# Altium schematic sheet Connectors.SchDoc
size A3
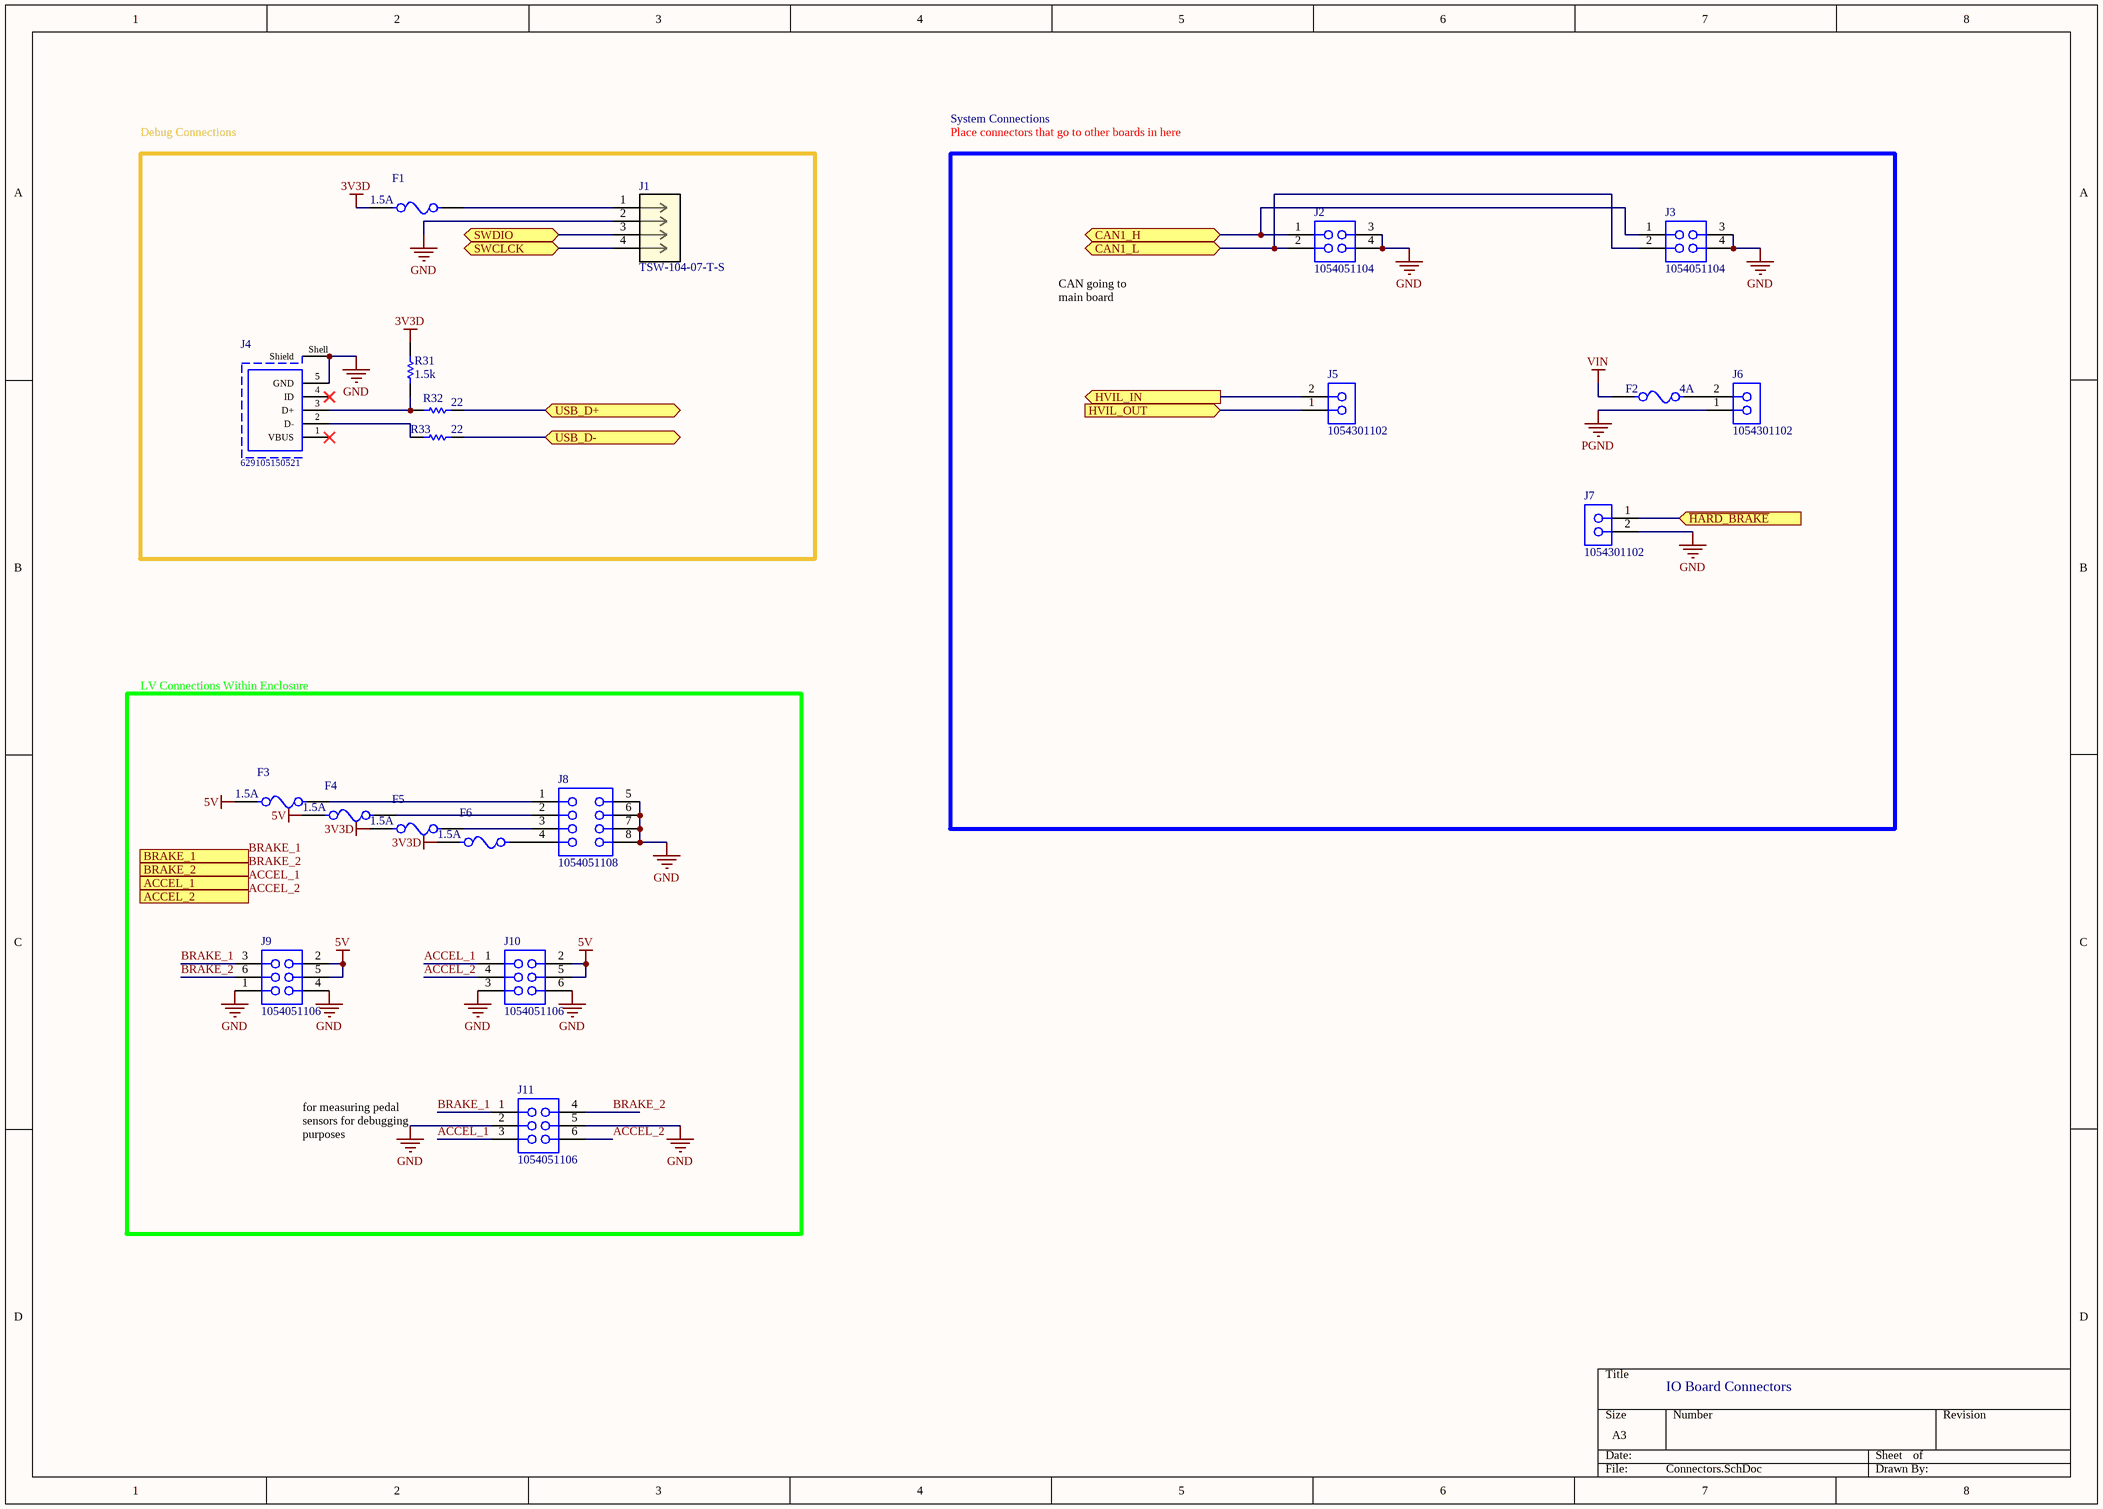
[diagram p0: Connectors.SchDoc]

## Parts
F1  1.5A  [FUSC1608X43N]
F2  4A  [0466004.NR]
F3  1.5A  [FUSC1608X43N]
F4  1.5A  [FUSC1608X43N]
F5  1.5A  [FUSC1608X43N]
F6  1.5A  [FUSC1608X43N]
J1  TSW-104-07-T-S  [CON4_1X4_TU_TSW]
J2  1054051104  [1054051104]
J3  1054051104  [1054051104]
J4  629105150521  [629105150521]
J5  1054301102  [1054301102]
J6  1054301102  [1054301102]
J7  1054301102  [1054301102]
J8  1054051108  [1054051108]
J9  1054051106  [1054051106]
J10  1054051106  [1054051106]
J11  1054051106  [1054051106]
R31  1.5k  [RESC2013X50X35ML15T15]
R32  22  [RESC0805(2012)_L]
R33  22  [RESC2013X50X35ML15T15]

## Blocks framed on the sheet
Debug Connections: F1 J1 J4 R31-R33
Place connectors that go to other boards in here: F2 J2 J3 J5-J7
LV Connections Within Enclosure: F3-F6 J8-J11

## Ports
ACCEL_1 (out), ACCEL_2 (out), BRAKE_1 (out), BRAKE_2 (out), CAN1_H (bidir), CAN1_L (bidir), HVIL_IN (out), HVIL_OUT (in), SWCLCK (bidir), SWDIO (bidir), USB_D+ (bidir), USB_D- (bidir), ~{HARD_BRAKE} (in)

## Nets
3V3D: F1.1 F5.1 F6.1 R31.1
5V: F3.1 F4.1 J9.2 J9.5 J10.2 J10.5
GND: J1.2 J2.3 J2.4 J3.3 J3.4 J4.5(GND) J4.Shell(Shield) J7.2 J8.5 J8.6 J8.7 J8.8 J9.1 J9.4 J10.3 J10.6 J11.2 J11.5
PGND: J6.1
VIN: F2.1
ACCEL_1: J10.1 J11.3 ; port ACCEL_1
ACCEL_2: J10.4 J11.6 ; port ACCEL_2
BRAKE_1: J9.3 J11.1 ; port BRAKE_1
BRAKE_2: J9.6 J11.4 ; port BRAKE_2
CAN1_H: J2.1 J3.1 ; port CAN1_H
CAN1_L: J2.2 J3.2 ; port CAN1_L
~{HARD_BRAKE}: J7.1 ; port ~{HARD_BRAKE}
HVIL_IN: J5.2 ; port HVIL_IN
HVIL_OUT: J5.1 ; port HVIL_OUT
SWCLCK: J1.4 ; port SWCLCK
SWDIO: J1.3 ; port SWDIO
USB_D+: R32.1 ; port USB_D+
USB_D-: R33.1 ; port USB_D-
NetF1_2: F1.2 J1.1
NetF2_2: F2.2 J6.2
NetF3_2: F3.2 J8.1
NetF4_2: F4.2 J8.2
NetF5_2: F5.2 J8.3
NetF6_2: F6.2 J8.4
NetJ4_2: J4.2(D-) R33.2
NetJ4_3: J4.3(D+) R31.2 R32.2

Not connected (* = marked no-connect by the designer): J4 1(VBUS)* 4(ID)*

## Notes on the sheet
- System Connections
- CAN going to main board
- for measuring pedal sensors for debugging purposes
- IO Board Connectors

## Library data of the parts
F1 F3-F6 = 046701.5NR: 1.5A 0603 Fuse; Manufacturer_Name: LITTELFUSE; Datasheet Link: https://www.littelfuse.com/~/media/electronics/datasheets/fuses/littelfuse_fuse_467_datasheet.pdf.pdf; Height: 0.432mm; Manufacturer_Part_Number: 046701.5NR; Arrow Part Number: 046701.5NR; Arrow Price/Stock: https://www.arrow.com/en/products/046701.5nr/littelfuse; Mouser Part Number: 576-046701.5NR; Mouser Price/Stock: https://www.mouser.com/Search/Refine.aspx?Keyword=576-046701.5NR; Value: 1.5A
F2 = 0466004.NR: FUSE BOARD MNT 4A 32VAC/VDC 1206; Manufacturer: Littelfuse; DC Cold Resistance: 14mR; Voltage Rating (AC): 32V; Fuse Type: Board Mount (Cartridge Style Excluded); Approvals: UL,CSA; Supplier 1: Digi-Key; Manufacturer Part Number: 0466004.NR; RoHS: Yes; Category: Fuses; Stock 1: 7288; Pricing 1: 1=0.85000, 5=0.82000, 10=0.76800, 50=0.63520, 100=0.52930, 250=0.51608, 500=0.43668, 1000=0.38376 (USD); Mount: Surface Mount; Case/Package: 1206; Case Code (Imperial): 1206; Case Code (Metric): 3216; Min Operating Temperature: -55°C; Max Operating Temperature: 90°C; Voltage Rating (DC): 32V; Current Rating: 4A; Packaging: Tape and Reel; Resistance: 14mR; Package Quantity: 5000; Fuse Current: 4A; Voltage Rating: 32V; Length: 3.18mm; Height: 0.023inch; Depth: 1.52mm; Width: 1.52mm; Lead Free: Lead Free; REACH SVHC: Unknown; ComponentLink1URL: https://datasheet.ciiva.com/16200/littelfuse-fuse-466-16200179.pdf?src-supplier=Future+Electronics; ComponentLink1Description: https://datasheet.ciiva.com/16200/littelfuse-fuse-466-16200179.pdf?src-supplier=Future+Electronics; ComponentLink2URL: https://datasheet.ciiva.com/1549/48294-1549713.pdf?src-supplier=Element14; ComponentLink2Description: https://datasheet.ciiva.com/1549/48294-1549713.pdf?src-supplier=Element14; ComponentLink3URL: https://datasheet.ciiva.com/7991/littelfuse-fuse-466-7991928.pdf?src-supplier=Element14; ComponentLink3Description: https://datasheet.ciiva.com/7991/littelfuse-fuse-466-7991928.pdf?src-supplier=Element14; ComponentLink4URL: https://datasheet.ciiva.com/46394/728615-46394826.pdf?src-supplier=Element14; ComponentLink4Description: https://datasheet.ciiva.com/46394/728615-46394826.pdf?src-supplier=Element14; ComponentLink5URL: https://datasheet.ciiva.com/22713/48294-22713051.pdf?src-supplier=Element14; ComponentLink5Description: https://datasheet.ciiva.com/22713/48294-22713051.pdf?src-supplier=Element14; ComponentLink6URL: https://datasheet.ciiva.com/301/466seriesdrawing-301660.pdf?src-supplier=Digi-Key; ComponentLink6Description: https://datasheet.ciiva.com/301/466seriesdrawing-301660.pdf?src-supplier=Digi-Key; ComponentLink7URL: https://datasheet.ciiva.com/301/466seriesdrawing-301661.pdf?src-supplier=Digi-Key; ComponentLink7Description: https://datasheet.ciiva.com/301/466seriesdrawing-301661.pdf?src-supplier=Digi-Key; ComponentLink8URL: https://datasheet.ciiva.com/301/466seriesdrawing-301662.pdf?src-supplier=Digi-Key; ComponentLink8Description: https://datasheet.ciiva.com/301/466seriesdrawing-301662.pdf?src-supplier=Digi-Key; Supplier Part Number 1: F1459CT-ND; Value: 4A
J1 = TSW-104-07-T-S: 4 Pin Header; Vendor: Samtec Inc; Built_By: EMA_UL_Team; Manufacturer_Part_Number: TSW-104-07-T-S; Copyright: Copyright (C) 2018 Accelerated Designs. All rights reserved; RefDes: RefDes; Type: DEV
J2 J3 = 1054051104: Nano-Fit Right-Angle Header, Surface Mount, 2.50mm Pitch, Dual Row, 4 Circuits, 0.76µm Tin (Sn) Plating, Black, Glow-Wire Capable; Manufacturer: Molex; Pitch: 2.5 mm; Part Number: 1054051104; ComponentLink2Description: Datasheet; Mounting Technology: Surface Mount; ComponentLink2URL: https://www.molex.com/webdocs/datasheets/pdf/en-us/1054051104_PCB_HEADERS.pdf; Orientation: Right
J4 = CMP-1502-03252-1: Micro USB 2.0 Type B Receptacle WR-COM, Horizontal, SMT, with Pegs, High Current at Pin 1 & Pin 5; Manufacturer: Wurth Elektronik; Contact Resistance: 30mOhm; Rated Current: 3A; Working Voltage: 30VAC; Package Reference: 629105150521; Mounting Technology: SMT; Connector Type: MicroUSB2.0TypeB; Operating Temperature: -40to85degC; Orientation: Horizontal; Manufacturer URL: http://www.we-online.de; Datasheet URL: https://katalog.we-online.de/em/datasheet/629105150521.pdf; Part Number: 629105150521; Packaging: TapeandReel; Gender: Receptacle; Publisher: WurthElektronik
J5-J7 = 1054301102: Nano-Fit Right-Angle Header, Surface Mount, 2.50mm Pitch, Single Row, 2 Circuits, 0.76µm Tin (Sn) Plating, Black, Glow-Wire Capable; Manufacturer: Molex; Pitch: 2.5 mm; Part Number: 1054301102; ComponentLink2Description: Datasheet; Mounting Technology: Surface Mount; ComponentLink2URL: https://www.molex.com/webdocs/datasheets/pdf/en-us/1054301102_PCB_HEADERS.pdf; Orientation: Right
J8 = 1054051108: Nano-Fit Right-Angle Header, Surface Mount, 2.50mm Pitch, Dual Row, 8 Circuits, 0.76µm Tin (Sn) Plating, Black, Glow-Wire Capable; Manufacturer: Molex; Part Number: 1053141108; Pitch: 2.5mm; ComponentLink2URL: https://www.molex.com/webdocs/datasheets/pdf/en-us/1054051108_PCB_HEADERS.pdf; ComponentLink2Description: Datasheet; Orientation: Right; Mounting Technology: Surface Mount
J9-J11 = 1054051106: Nano-Fit Right-Angle Header, Surface Mount, 2.50mm Pitch, Dual Row, 6 Circuits, 0.76µm Tin (Sn) Plating, Black, Glow-Wire Capable; Manufacturer: Molex; Pitch: 2.5 mm; Part Number: 1054051106; ComponentLink2Description: Datasheet; Mounting Technology: Surface Mount; ComponentLink2URL: https://www.molex.com/webdocs/datasheets/pdf/en-us/1054051106_PCB_HEADERS.pdf; Orientation: Right
R31 = CMP-009-00001-4: Chip Resistor,1.5k Ohm, +/- 1%, 125 mW, -55 to 155 degC, 0805 (2012 Metric); Power: 125mW; Voltage Rating: 150V; Tolerance: 1%; Mounting Technology: SM; Value: 1.5k; Min Operating Temperature: -55°C; Case/Package: 0805; Pins: 2; Max Operating Temperature: 155°C; RoHS Compliant: True
R32 = CMP-1013-00736-1: 100K 0.125W 1% 0805 (2012 Metric)  SMD; Case-Metric: 2012; Case-EIA: 0805; Value: 22; Tolerance: 1 %; Technology: SMT; Power: 0.125 W
R33 = CMP-009-00001-4: Chip Resistor, 22 Ohm, +/- 1%, 125 mW, -55 to 155 degC, 0805 (2012 Metric); Power: 125mW; Voltage Rating: 150V; Tolerance: 1%; Mounting Technology: SM; Value: 22; Min Operating Temperature: -55°C; Case/Package: 0805; Pins: 2; Max Operating Temperature: 155°C; RoHS Compliant: True